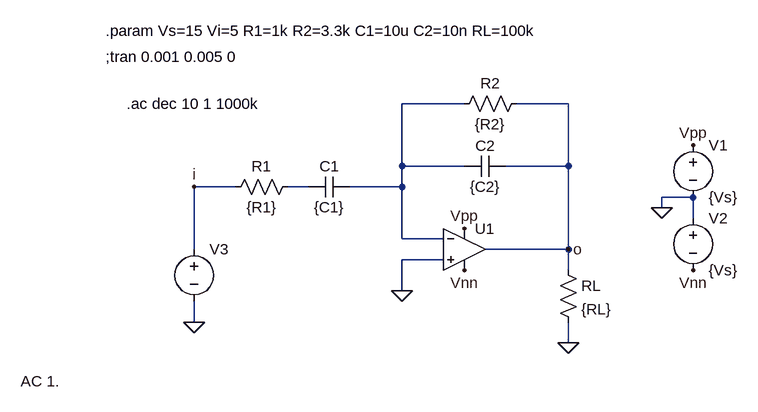
[diagram p0: schematic Filter03.asc]
Filter03.asc, the LTspice schematic file:
Version 4
SHEET 1 968 680
WIRE 160 0 64 0
WIRE 320 0 240 0
WIRE 64 96 64 0
WIRE 160 96 64 96
WIRE 320 96 320 0
WIRE 320 96 224 96
WIRE -192 128 -256 128
WIRE -80 128 -112 128
WIRE 64 128 64 96
WIRE 64 128 -16 128
WIRE 512 144 464 144
WIRE 464 160 464 144
WIRE 512 176 512 144
WIRE 64 208 64 128
WIRE 128 208 64 208
WIRE -256 224 -256 128
WIRE 320 224 320 96
WIRE 320 224 192 224
WIRE 128 240 64 240
WIRE 320 256 320 224
WIRE 64 288 64 240
WIRE -256 336 -256 304
WIRE 320 368 320 336
FLAG 512 64 Vpp
FLAG 464 160 0
FLAG 512 256 Vnn
FLAG 320 368 0
FLAG -256 336 0
FLAG 160 192 Vpp
FLAG 160 256 Vnn
FLAG 64 288 0
FLAG 320 224 o
FLAG -256 128 i
SYMBOL voltage 512 48 R0
WINDOW 123 0 0 Left 0
WINDOW 39 0 0 Left 0
SYMATTR InstName V1
SYMATTR Value {Vs}
SYMBOL voltage 512 160 R0
WINDOW 123 0 0 Left 0
WINDOW 39 0 0 Left 0
SYMATTR InstName V2
SYMATTR Value {Vs}
SYMBOL res 304 240 R0
SYMATTR InstName RL
SYMATTR Value {RL}
SYMBOL voltage -256 208 R0
WINDOW 3 -267 219 Left 2
WINDOW 123 0 0 Left 0
WINDOW 39 0 0 Left 0
SYMATTR Value AC 1.
SYMATTR InstName V3
SYMBOL Opamps\\UniversalOpamp2 160 224 R0
SYMATTR InstName U1
SYMBOL cap -16 112 R90
WINDOW 0 0 32 VBottom 2
WINDOW 3 32 32 VTop 2
SYMATTR InstName C1
SYMATTR Value {C1}
SYMBOL res -96 112 R90
WINDOW 0 0 56 VBottom 2
WINDOW 3 32 56 VTop 2
SYMATTR InstName R1
SYMATTR Value {R1}
SYMBOL res 256 -16 R90
WINDOW 0 0 56 VBottom 2
WINDOW 3 32 56 VTop 2
SYMATTR InstName R2
SYMATTR Value {R2}
SYMBOL cap 224 80 R90
WINDOW 0 0 32 VBottom 2
WINDOW 3 32 32 VTop 2
SYMATTR InstName C2
SYMATTR Value {C2}
TEXT -392 -112 Left 2 !.param Vs=15 Vi=5 R1=1k R2=3.3k C1=10u C2=10n RL=100k
TEXT -392 -72 Left 2 !;tran 0.001 0.005 0
TEXT -360 0 Left 2 !.ac dec 10 1 1000k

The netlist it stands for:
* Filter03.asc
V1 Vpp 0 {Vs}
V2 0 Vnn {Vs}
RL o 0 {RL}
V3 i 0 AC 1.
XU1 0 N001 Vpp Vnn o level.2 Avol=1Meg GBW=10Meg Slew=10Meg ilimit=25m rail=0 Vos=0 phimargin=45 en=0 enk=0 in=0 ink=0 Rin=500Meg  ; pins IN+ IN- V+ V- OUT
C1 N001 N002 {C1}
R1 N002 i {R1}
R2 o N001 {R2}
C2 o N001 {C2}
.param Vs=15 Vi=5 R1=1k R2=3.3k C1=10u C2=10n RL=100k
;tran 0.001 0.005 0
.ac dec 10 1 1000k
.lib UniversalOpamps2.sub
.backanno
.end